# EAGLE design plantSensor_555 (EAGLE 7.3.0)
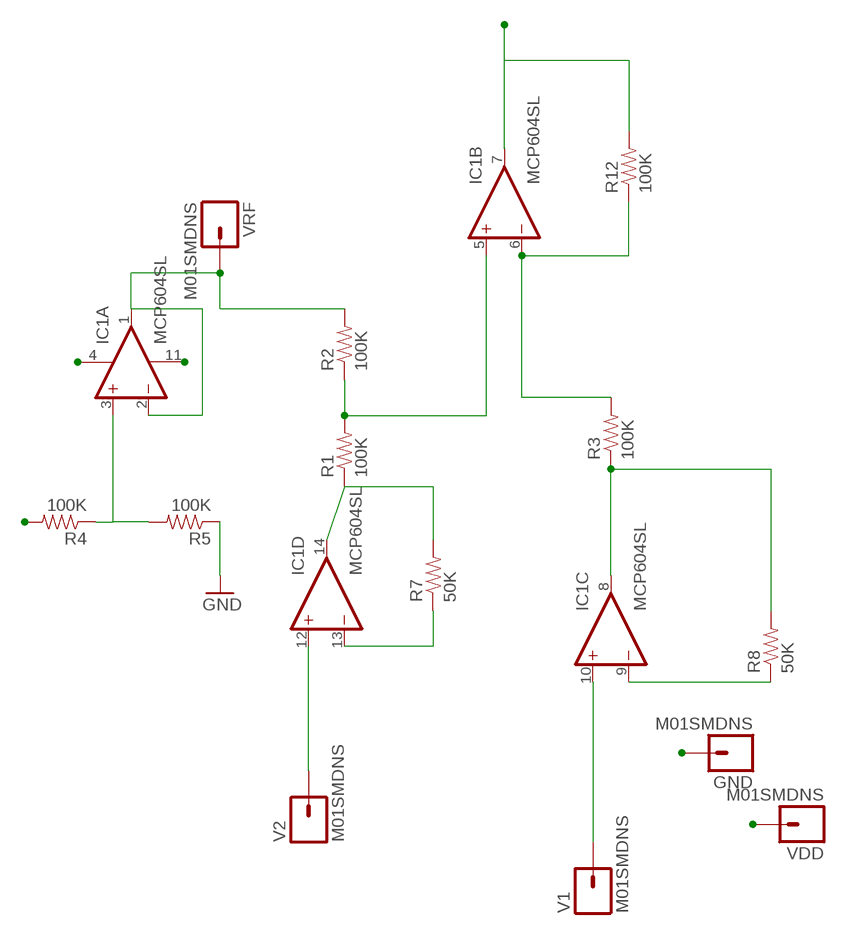
[diagram p0: schematic, sheet 1, part 1 of 2]
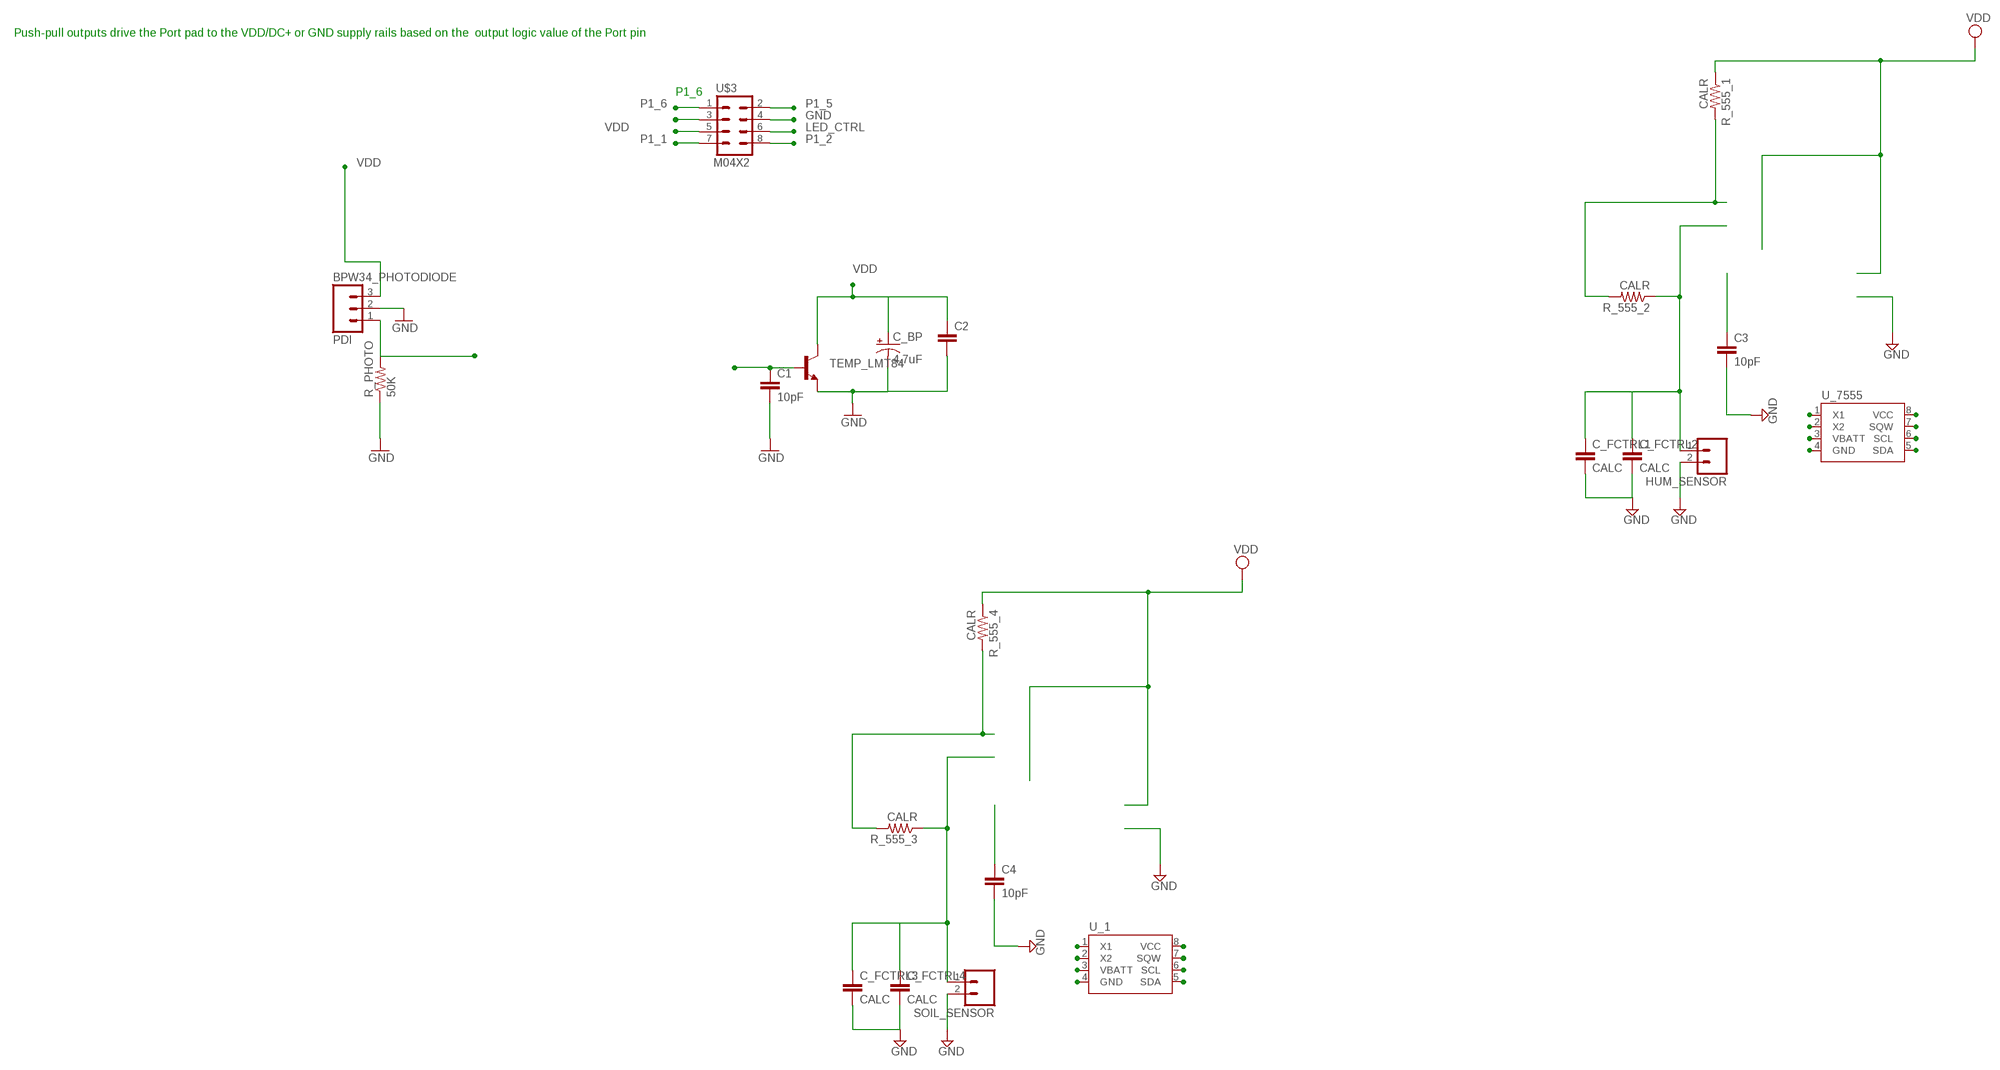
[diagram p1: schematic, sheet 1, part 2 of 2]

## Parts
BPW34_PHOTODIODE  PDI  M03PTH  [1X03]
C1  10pF  CAP0805  [0805]
C2  CAP0805  [0805]
C3  10pF  CAP0805  [0805]
C4  10pF  CAP0805  [0805]
C_BP  4.7uF  10UF-TANT  [EIA3216]
C_FCTRL1  CALC  CAP0805  [0805]
C_FCTRL2  CALC  CAP0805  [0805]
C_FCTRL3  CALC  CAP0805  [0805]
C_FCTRL4  CALC  CAP0805  [0805]
GND  M01SMDNS  [1X01NS]
HUM_SENSOR  M02LOCK  [1X02_LOCK]
IC1  MCP604SL  [SO14]
R1  100K  RESISTOR  [0805]
R2  100K  RESISTOR  [0805]
R3  100K  RESISTOR  [0805]
R4  100K  RESISTOR  [0805]
R5  100K  RESISTOR  [0805]
R7  50K  RESISTOR  [0805]
R8  50K  RESISTOR  [0805]
R12  100K  RESISTOR  [0805]
R_555_1  CALR  RESISTOR  [0805]
R_555_2  CALR  RESISTOR  [0805]
R_555_3  CALR  RESISTOR  [0805]
R_555_4  CALR  RESISTOR  [0805]
R_PHOTO  50K  RESISTOR  [0805]
SOIL_SENSOR  M02LOCK  [1X02_LOCK]
TEMP_LMT84  TRANSISTOR_NPNTO92  [TO-92]
U$3  M04X2  [2X4]
U_1  DS1307SO8  [SO08]
U_7555  DS1307SO8  [SO08]
V1  M01SMDNS  [1X01NS]
V2  M01SMDNS  [1X01NS]
VDD  M01SMDNS  [1X01NS]
VRF  M01SMDNS  [1X01NS]

## Nets
GND: BPW34_PHOTODIODE.2 C1.2 C2.2 C3.2 C4.2 C_BP.C(-) C_FCTRL1.2 C_FCTRL2.2 C_FCTRL3.2 C_FCTRL4.2 GND.1 HUM_SENSOR.2 IC1.11(P:V-) R5.1 R_PHOTO.1 SOIL_SENSOR.2 TEMP_LMT84.1(E) U$3.4 U_1.1(X1) U_7555.1(X1)
LED_CTRL: U$3.6
N$1: IC1.10(C:+IN) V1.1
N$2: IC1.3(A:+IN) R4.1 R5.2
N$3: IC1.13(D:-IN) R7.1
N$4: IC1.12(D:+IN) V2.1
N$7: IC1.5(B:+IN) R1.2 R2.1
N$92: IC1.9(C:-IN) R8.1
N$93: IC1.8(C:OUT) R3.1 R8.2
N$96: IC1.14(D:OUT) R1.1 R7.2
N$100: IC1.6(B:-IN) R3.2 R12.1
P1: C4.1 U_1.5(SDA)
P1_1: IC1.7(B:OUT) R12.2 U$3.7
P1_2: C1.1 TEMP_LMT84.2(B) U$3.8
P1_4: BPW34_PHOTODIODE.1 R_PHOTO.2 U$3.3
P1_5: U$3.2 U_1.3(VBATT)
P1_6: U$3.1 U_7555.3(VBATT)
P2: C_FCTRL1.1 C_FCTRL2.1 HUM_SENSOR.1 R_555_2.1 U_7555.2(X2) U_7555.6(SCL)
P3: C_FCTRL3.1 C_FCTRL4.1 R_555_3.1 SOIL_SENSOR.1 U_1.2(X2) U_1.6(SCL)
P4: R_555_3.2 R_555_4.2 U_1.7(SQW)
P5: C3.1 U_7555.5(SDA)
P7: R_555_1.2 R_555_2.2 U_7555.7(SQW)
VDD: BPW34_PHOTODIODE.3 C2.1 C_BP.A(+) IC1.4(P:V+) R4.2 R_555_1.1 R_555_4.1 TEMP_LMT84.3(C) U$3.5 U_1.4(GND) U_1.8(VCC) U_7555.4(GND) U_7555.8(VCC) VDD.1
VRF: IC1.1(A:OUT) IC1.2(A:-IN) R2.2 VRF.1

## Notes on the sheet
- Push-pull outputs drive the Port pad to the VDD/DC+ or GND supply rails based on the  output logic value of the Port pin
- P1_6

## Library data of the parts
BPW34_PHOTODIODE = SparkFun-Connectors:M03: Header 3 Standard 3-pin 0.1" header. Use with straight break away headers (SKU : PRT-00116), right angle break away headers (PRT-00553), swiss pins (PRT-00743), machine pins (PRT-00117), and female headers (PRT-00115). Molex polarized connector foot print use with SKU : PRT-08232 with associated crimp pins and housings.
C1-C4 C_FCTRL1-C_FCTRL4 = SparkFun-Capacitors:CAP: Capacitor Standard 0603 ceramic capacitor, and 0.1" leaded capacitor.
C_BP = SparkFun-Capacitors:10UF-TANT: 10uF Tantalum SMT CAP-00811- 16V 10% (EIA-3216); PROD_ID: CAP-00811; VALUE: 10uF
GND V1 V2 VDD VRF = SparkFun-Connectors:M01: Header 1 Standard 1-pin 0.1" header. Use with straight break away headers (SKU : PRT-00116), right angle break away headers (PRT-00553), swiss pins (PRT-00743), machine pins (PRT-00117), and female headers (PRT-00115).
HUM_SENSOR SOIL_SENSOR = SparkFun-Connectors:M02: Header 2 Standard 2-pin 0.1" header. Use with straight break away headers (SKU : PRT-00116), right angle break away headers (PRT-00553), swiss pins (PRT-00743), machine pins (PRT-00117), and female headers (PRT-00115). Molex polarized connector foot print use with SKU : PRT-08233 with associated crimp pins and housings.
IC1 = linear:MCP604: Quad Op Amp 2.7V to 6.0V Single Supply CMOS Source: http://ww1.microchip.com/downloads/en/DeviceDoc/21314g.pdf
R1-R5 R7 R8 R12 R_555_1-R_555_4 R_PHOTO = SparkFun:RESISTOR: Resistor Basic schematic elements and footprints for 0603, 1206, and PTH 1/10th watt (small) resistors.
TEMP_LMT84 = SparkFun-DiscreteSemi:TRANSISTOR_NPN: Generic NPN BJT. MMBT2222 is the common NPN we use. Double check against datasheet- not all devices are the same!
U$3 = SparkFun-Connectors:M04X2: .1" header, two rows of four.
U_1 U_7555 = SparkFun-FreqCtrl:DS1307: I2C real-time clock with battery backup.

## Board
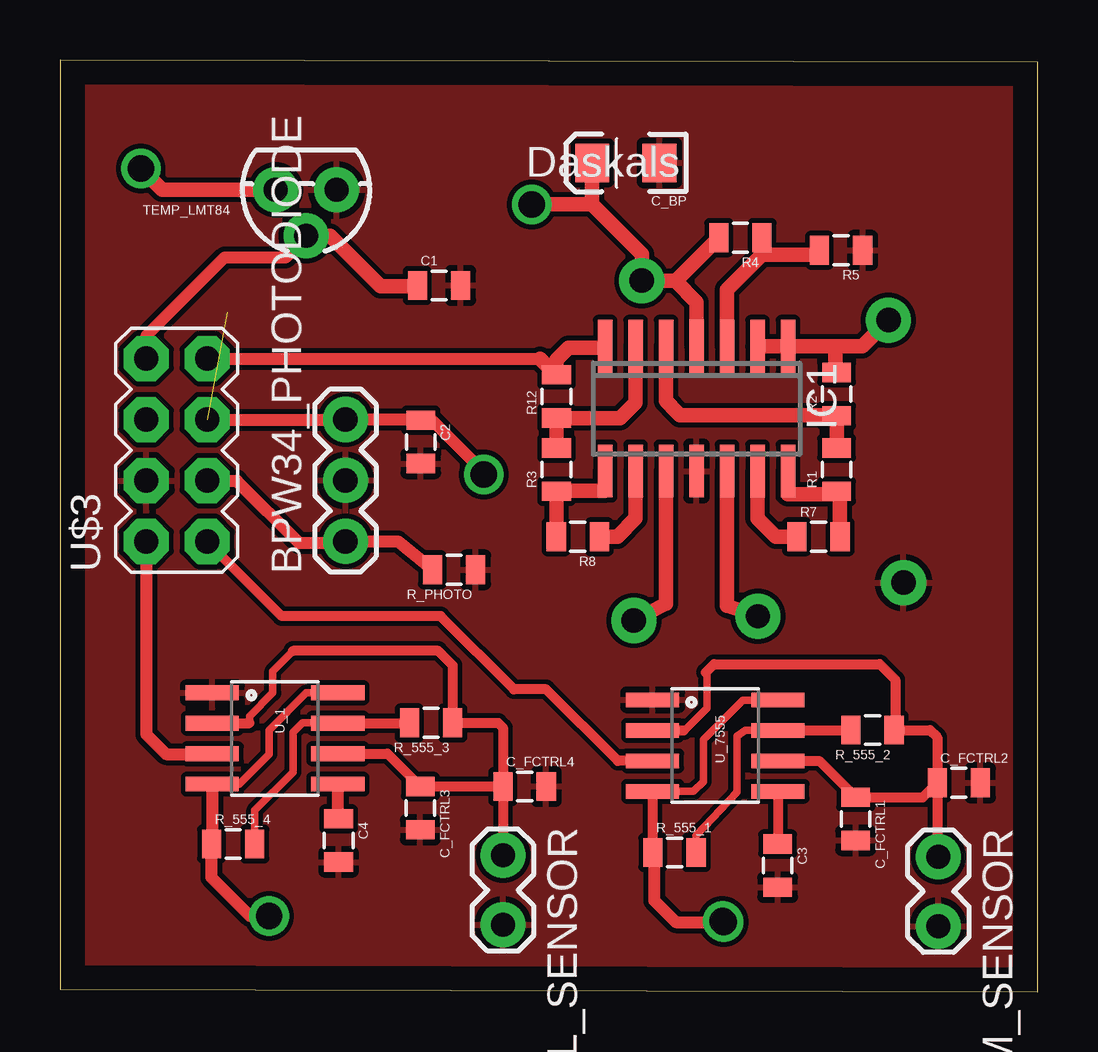
[diagram p2: board, top side]
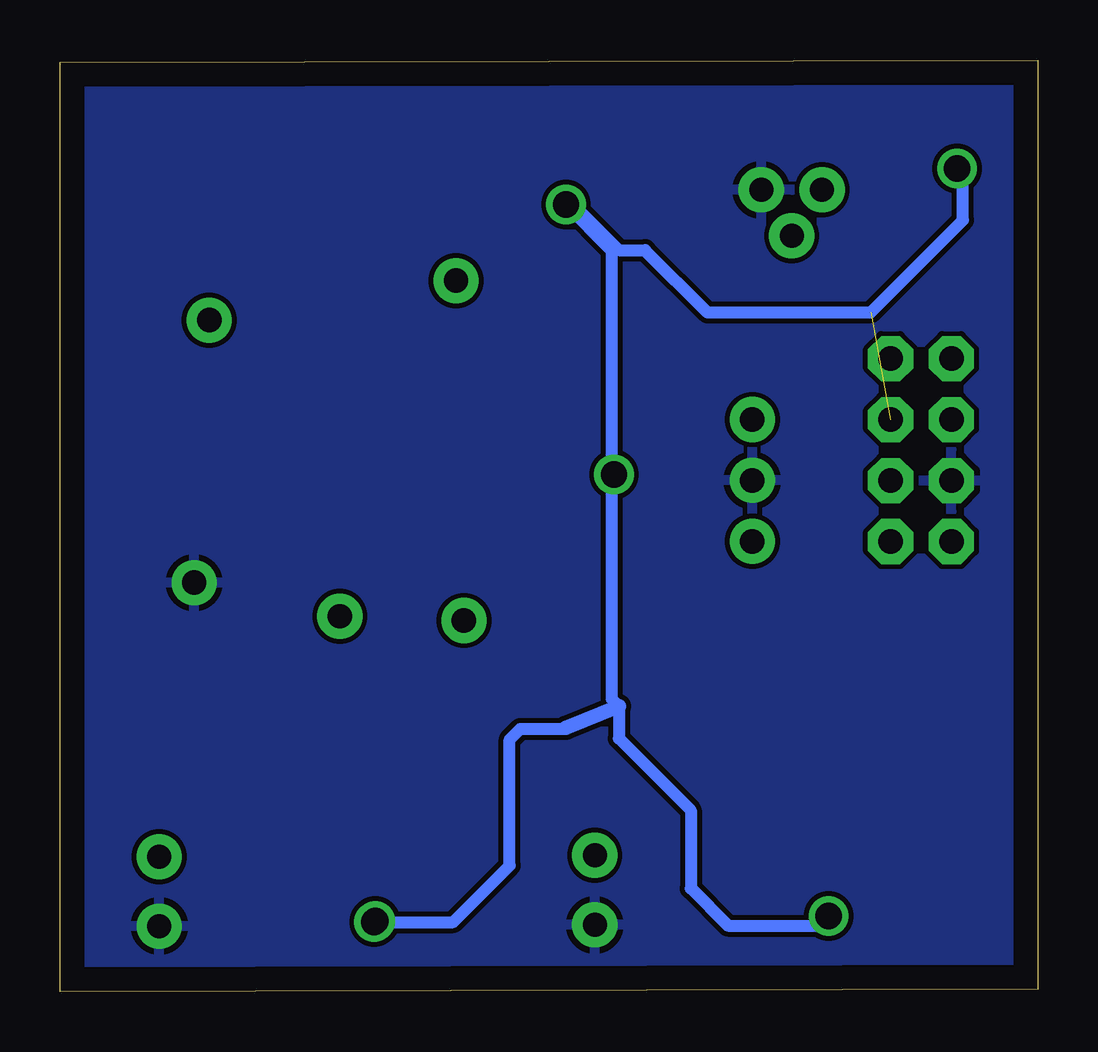
[diagram p3: board, bottom side, seen from below]

Size 40.76 x 38.83 mm. Coordinates in mm from the lower left corner, seen from the top.
Outline: 0,0.1 40.76,0 40.76,38.73 0,38.83 0,0.1
Copper layers (1*16): Top 0.035mm / dielectric 1.5mm / Bottom 0.035mm
Design rules "default": minimum track width 10mil, minimum drill 24mil, track to track 8mil, track to pad 8mil, pad to pad 8mil, via to via 8mil, smd to smd 8mil, copper to edge 40mil, drill to drill 8mil, minimum pad ring 10mil, minimum via ring 8mil, stop-mask expansion 4mil, vias tented up to drill 0mil, thermal gap 10mil

### Footprints (pad centres in the part's own frame; a part is rotated, then mirrored left to right if it is on the bottom)
1X03 = drill 1.016 pad 1.88: 1 0,0; 2 2.54,0; 3 5.08,0
0805 = smd 0.8 x 1.2: 1 -0.9,0; 2 0.9,0
EIA3216 = smd 1.4 x 1.6: A 1.4,0; C -1.4,0
1X01NS = drill 1.016 pad 1.88: 1 0,0
1X02_LOCK = drill 1 pad 1.88: 1 -0.178,0; 2 2.718,0
SO14 = smd 0.6 x 2.2: 1 -3.81,-2.6; 2 -2.54,-2.6; 3 -1.27,-2.6; 4 0,-2.6; 5 1.27,-2.6; 6 2.54,-2.6; 7 3.81,-2.6; 8 3.81,2.6; 9 2.54,2.6; 10 1.27,2.6; 11 0,2.6; 12 -1.27,2.6; 13 -2.54,2.6; 14 -3.81,2.6
TO-92 = drill 1 pad 1.88: 1 -1.27,0; 2 0,1.905; 3 1.27,0
2X4 = drill 1.016 pad 1.88 octagon: 1 -3.81,-1.27; 2 -3.81,1.27; 3 -1.27,-1.27; 4 -1.27,1.27; 5 1.27,-1.27; 6 1.27,1.27; 7 3.81,-1.27; 8 3.81,1.27
SO08 = smd 0.61 x 2.21: 1 -1.905,-2.616; 2 -0.635,-2.616; 3 0.635,-2.616; 4 1.905,-2.616; 5 1.905,2.616; 6 0.635,2.616; 7 -0.635,2.616; 8 -1.905,2.616

### Placement (x,y rotation side)
BPW34_PHOTODIODE  11.9,18.77 90 top
C1  15.8,29.43 0 top
C2  15.04,22.91 270 top
C3  29.92,5.26 270 top
C4  11.62,6.31 270 top
C_BP  23.59,34.54 180 top
C_FCTRL1  33.17,7.21 270 top
C_FCTRL2  37.47,8.71 0 top
C_FCTRL3  15.02,7.66 270 top
C_FCTRL4  19.37,8.56 0 top
GND  35.17,17.05 0 top
HUM_SENSOR  36.62,5.46 270 top
IC1  26.54,24.3 180 top
R1  32.38,21.76 90 top
R2  32.38,24.91 90 top
R3  20.7,21.76 90 top
R4  28.37,31.42 180 top
R5  32.56,30.9 180 top
R7  31.62,18.96 0 top
R8  21.58,18.96 180 top
R12  20.7,24.81 90 top
R_555_1  25.62,5.81 0 top
R_555_2  33.87,10.91 180 top
R_555_3  15.47,11.21 180 top
R_555_4  7.22,6.16 0 top
R_PHOTO  16.43,17.59 180 top
SOIL_SENSOR  18.47,5.51 270 top
TEMP_LMT84  10.26,33.41 180 top
U$3  4.87,22.57 90 top
U_1  8.97,10.56 270 top
U_7555  27.32,10.26 270 top
V1  23.92,15.47 0 top
V2  29.09,15.65 0 top
VDD  24.25,29.63 0 top
VRF  34.54,27.99 0 top

### Tracks (layer width: path | path; a pad name or v marks a point on that pad's centre or on a via)
GND
  pour Top: 17.33,40.5 41.11,40.52 41.73,-1.18 -0.88,-0.77 -0.85,40.28
  pour Bottom: -1.61,39.13 -1.28,-0.08 42.47,-0.78 42.12,38.9
N$1
  Top 0.61: IC1.10 25.27,16.17 V1.1
N$2
  Top 0.61: IC1.3 27.81,29.25 29.27,30.71 | R4.1 29.27,30.71 | 29.27,30.71 31.47,30.71 R5.2
N$3
  Top 0.61: IC1.13 29.08,19.73 29.84,18.96 R7.1
N$4
  Top 0.61: IC1.12 27.81,16.08 V2.1
N$5  (via drill 1.1)
  other vias: 8.72,3.16
N$6  (via drill 1.1)
  other vias: 17.67,21.56
N$7
  Top 0.61: R1.2 R2.1 25.85,24.02 25.5,24.37 25.5,24.4 25.27,24.63 IC1.5
N$9  (via drill 1.1)
  other vias: 27.62,2.96
N$92
  Top 0.61: R8.1 23.23,18.96 24,19.73 IC1.9
N$93
  Top 0.254: R3.1 20.81,20.86 | 20.7,19.36 R8.2
  Top 0.61: R8.2 R3.1 22.73,20.87 IC1.8
N$96
  Top 0.61: IC1.14 30.35,20.74 32.63,20.74 32.52,20.86 R1.1 32.52,20.72 R7.2
N$100
  Top 0.61: R3.2 R12.1 23.35,23.91 24,24.55 IC1.6
P1
  Top 0.5: U_1.5 11.58,7.24 C4.1
P1_1
  Top 0.5: U$3.7 20.02,26.38
  Top 0.61: IC1.7 22.67,26.84 21.2,26.84 20.7,26.33 R12.2 20.02,26.38
P1_2
  Top 0.5: U$3.8 3.6,27.34 6.87,30.61 9.36,30.61 9.4,30.64
  Top 0.61: 9.4,30.64 TEMP_LMT84.2 11.27,31.51 13.37,29.41 14.87,29.41 C1.1
P1_4
  Top 0.5: U$3.3 7.37,21.3 9.97,18.71 11.84,18.71 BPW34_PHOTODIODE.1 14.08,18.77 R_PHOTO.2
P1_5
  Top 0.5: U$3.2 3.6,10.73 4.42,9.91 5.54,9.91 U_1.3
P1_6
  Top 0.406: U_7555.3 23.25,9.62 20.27,12.61 18.92,12.61 15.87,15.66 9.24,15.66 U$3.1
P2
  Top 0.305: 26,10.89 26.05,10.89 26.97,11.81 26.97,13.26 26.92,13.31
  Top 0.406: U_7555.2 26,10.89 | 26.92,13.31 27.27,13.66 34.17,13.66 34.82,13.01 34.82,10.96 R_555_2.1 36.27,10.91 36.57,10.61 C_FCTRL2.1 | U_7555.6 31.65,9.62 C_FCTRL1.1 35.97,8.11 C_FCTRL2.1 | C_FCTRL2.1 36.57,5.69 HUM_SENSOR.1
P3
  Top 0.305: 7.9,11.19 7.9,11.49 8.87,12.46 8.87,13.36 9.72,14.21
  Top 0.406: U_1.2 7.9,11.19 | 9.72,14.21 15.77,14.21 16.37,13.61 R_555_3.1 18.27,11.21 18.47,11.01 C_FCTRL4.1 | U_1.6 13.65,9.92 C_FCTRL3.1 C_FCTRL4.1 | C_FCTRL4.1 SOIL_SENSOR.1
P4
  Top 0.305: R_555_4.2 8.12,7.56 9.72,9.16 9.72,10.81 10.12,11.21 11.57,11.21 U_1.7
  Top 0.406: U_1.7 14.55,11.19 R_555_3.2
P5
  Top 0.406: U_7555.5 29.93,6.17 C3.1
P7
  Top 0.305: R_555_1.2 26.52,6.51 28.22,8.31 28.22,10.66 28.57,10.91 29.92,10.91 U_7555.7
  Top 0.406: U_7555.7 32.95,10.89 R_555_2.2
VDD  (via drill 1.1)  (1 unrouted)
  Top 0.305: U_7555.8 28.47,12.16 26.82,10.51 26.82,8.76 26.41,8.35 U_7555.4 24.7,5.72 24.77,5.66 | U_1.4 7.46,8.65 8.72,9.91 8.72,10.91 10.27,12.46 U_1.8
  Top 0.406: U_7555.4 24.7,5.82 R_555_1.1 | 29.02,12.21 29.89,12.21 U_7555.8
  Top 0.5: U_1.4 6.35,6.19 R_555_4.1 6.32,4.76 7.92,3.16 v8.72,3.16 | 24.77,5.66 24.77,3.81 25.67,2.91 v27.67,2.91 | U$3.5 11.9,23.84 BPW34_PHOTODIODE.3 | BPW34_PHOTODIODE.3 15,23.85 C2.1 | BPW34_PHOTODIODE.3 15.48,23.85 17.77,21.56
  Top 0.61: 25.65,29.63 VDD.1 24.25,30.72 22.17,32.81 | 25.65,29.63 26.54,28.74 IC1.4 | 25.65,29.63 25.67,29.63 R4.2 | 22.17,32.81 22.17,34.52 C_BP.A | 22.17,32.81 v19.67,32.81 | TEMP_LMT84.3 4.26,33.41 v3.37,34.31
  Bottom 0.5: v27.67,2.91 24.37,2.91 22.02,5.26 22.02,10.51 21.57,10.96 19.72,10.96 19.67,11.01 | v8.72,3.16 9.12,2.76 12.92,2.76 14.47,4.31 14.47,7.56 17.47,10.56 17.47,11.91 17.77,12.21 17.77,30.91 v19.67,32.81 19.37,32.81 17.47,30.91 16.37,30.91 13.77,28.31 6.97,28.31 3.12,32.16 3.12,34.06 v3.37,34.31
  Bottom 0.61: 19.67,11.01 17.47,11.91
VRF
  Top 0.61: IC1.2 IC1.1 32.33,26.9 | R2.2 32.33,25.81 32.33,26.9 | 32.33,26.9 33.45,26.9 VRF.1

### Text on the board
tPlace: Daskals